# EAGLE design M220 (EAGLE 6.6.0)
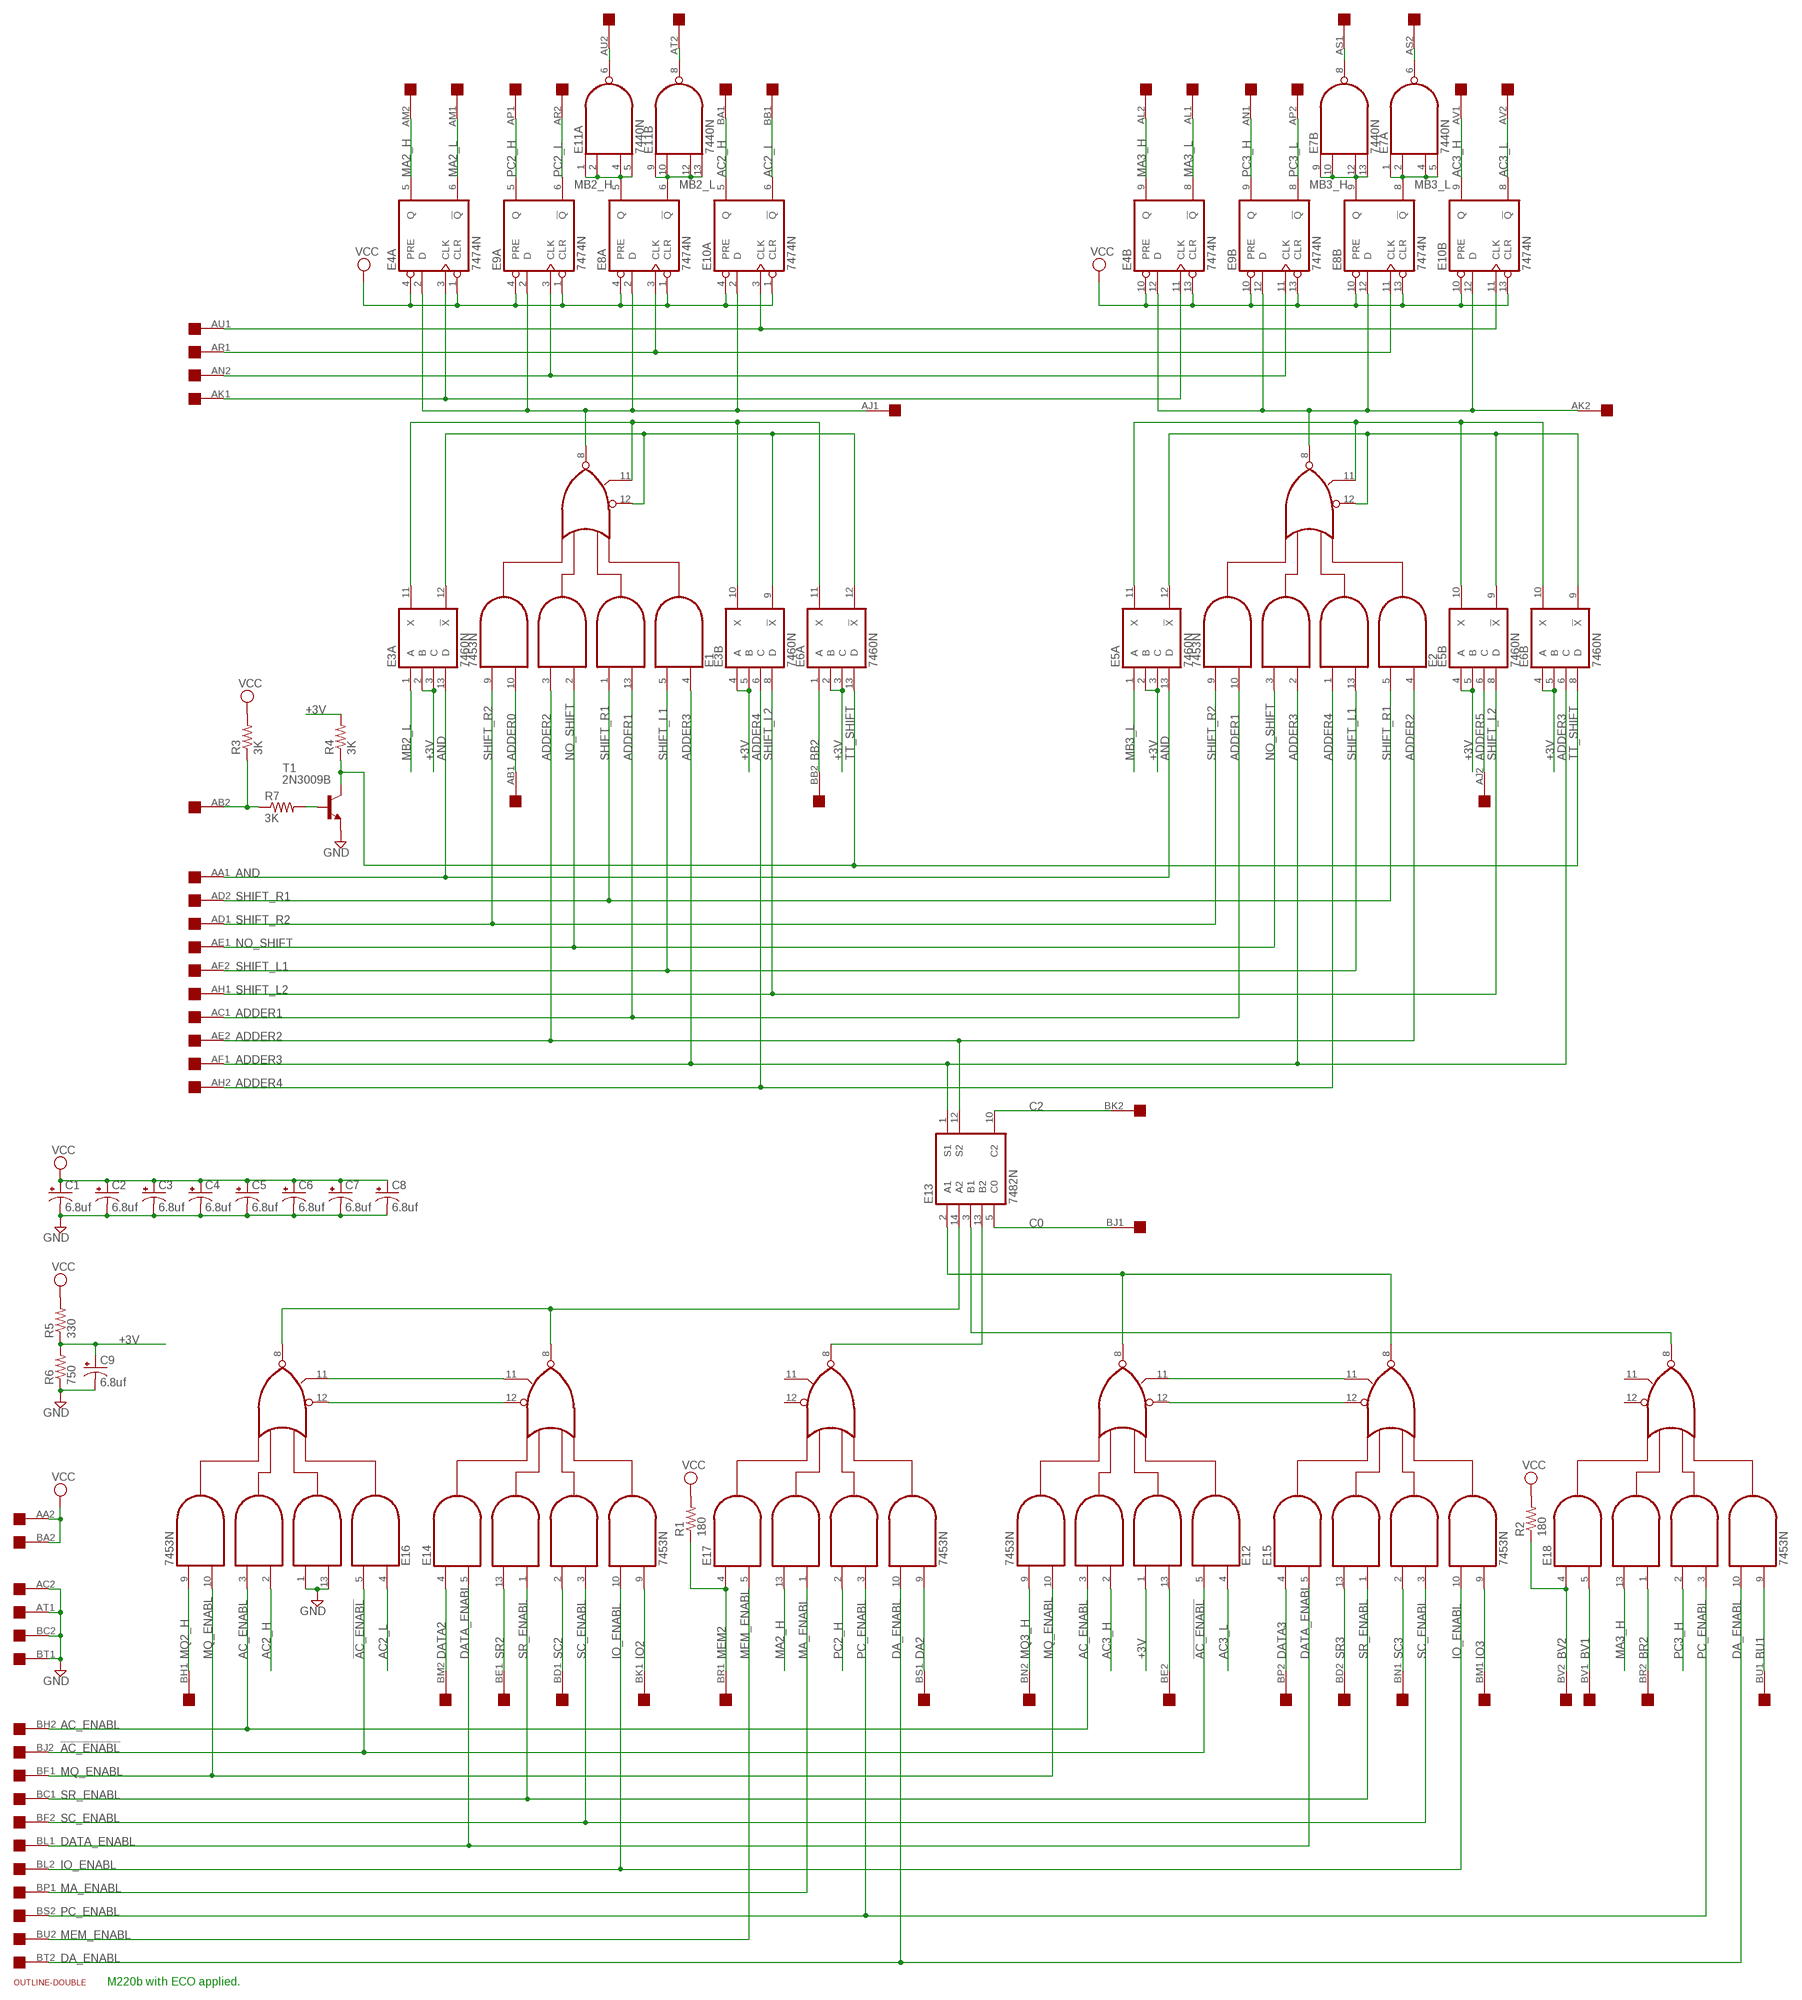
[diagram p0: schematic, sheet 1]

## Parts
C1  6.8uf  CPOL-USE15-5AXIAL  [E15-5]
C2  6.8uf  CPOL-USE15-5AXIAL  [E15-5]
C3  6.8uf  CPOL-USE15-5AXIAL  [E15-5]
C4  6.8uf  CPOL-USE15-5AXIAL  [E15-5]
C5  6.8uf  CPOL-USE15-5AXIAL  [E15-5]
C6  6.8uf  CPOL-USE15-5AXIAL  [E15-5]
C7  6.8uf  CPOL-USE15-5AXIAL  [E15-5]
C8  6.8uf  CPOL-USE15-5AXIAL  [E15-5]
C9  6.8uf  CPOL-USE15-5AXIAL  [E15-5]
E1  7453N  [DIL14]
E2  7453N  [DIL14]
E3  7460N  [DIL14]
E4  7474N  74S74N  [DIL14]
E5  7460N  [DIL14]
E6  7460N  [DIL14]
E7  7440N  74S20N  [DIL14]
E8  7474N  74S74N  [DIL14]
E9  7474N  74S74N  [DIL14]
E10  7474N  74S74N  [DIL14]
E11  7440N  74S20N  [DIL14]
E12  7453N  [DIL14]
E13  7482N  [DIL14]
E14  7453N  [DIL14]
E15  7453N  [DIL14]
E16  7453N  [DIL14]
E17  7453N  [DIL14]
E18  7453N  [DIL14]
R1  180  R-US_0207/10  [0207/10]
R2  180  R-US_0207/10  [0207/10]
R3  3K  R-US_0207/10  [0207/10]
R4  3K  R-US_0207/10  [0207/10]
R5  330  R-US_0207/10  [0207/10]
R6  750  R-US_0207/10  [0207/10]
R7  3K  R-US_0207/10  [0207/10]
T1  2N3009B  2N1613  [TO5]
U$1  DOUBLE  [EDGE-CON4]
U$2  OUTLINE-DOUBLE  [DOUBLE]

## Nets
!AC_ENABL: E12.5(I2) E16.5(I2) U$1.BJ2
!TT_SHIFT: R3.1 R7.1 U$1.AB2
+3V: C9.+ E3.2(A:B) E3.3(A:C) E3.4(B:A) E3.5(B:B) E5.2(A:B) E5.3(A:C) E5.4(B:A) E5.5(B:B) E6.2(A:B) E6.3(A:C) E6.4(B:A) E6.5(B:B) E12.1(I4) R4.2 R5.1 R6.2
AC2_H: E10.5(A:Q) E16.2(I5) U$1.BA1
AC2_L: E10.6(A:!Q) E16.4(I1) U$1.BB1
AC3_H: E10.9(B:Q) E12.2(I5) U$1.AV1
AC3_L: E10.8(B:!Q) E12.4(I1) U$1.AV2
AC_ENABL: E12.3(I6) E16.3(I6) U$1.BH2
ADDER0: E1.10(I7) U$1.AB1
ADDER1: E1.13(I3) E2.10(I7) U$1.AC1
ADDER2: E1.3(I6) E2.4(I1) E13.12(S2) U$1.AE2
ADDER3: E1.4(I1) E2.2(I5) E6.6(B:C) E13.1(S1) U$1.AF1
ADDER4: E2.1(I4) E3.6(B:C) U$1.AH2
ADDER5: E5.6(B:C) U$1.AJ2
AJ1: E1.8(O) E4.2(A:D) E8.2(A:D) E9.2(A:D) E10.2(A:D) U$1.AJ1
AK1: E4.3(A:CLK) E4.11(B:CLK) U$1.AK1
AK2: E2.8(O) E4.12(B:D) E8.12(B:D) E9.12(B:D) E10.12(B:D) U$1.AK2
AN2: E9.3(A:CLK) E9.11(B:CLK) U$1.AN2
AND: E3.13(A:D) E5.13(A:D) U$1.AA1
AR1: E8.3(A:CLK) E8.11(B:CLK) U$1.AR1
AS1: E7.8(B:O) U$1.AS1
AS2: E7.6(A:O) U$1.AS2
AT2: E11.8(B:O) U$1.AT2
AU1: E10.3(A:CLK) E10.11(B:CLK) U$1.AU1
AU2: E11.6(A:O) U$1.AU2
BB2: E6.1(A:A) U$1.BB2
BE2: E12.13(I3) U$1.BE2
BR2: E18.1(I4) U$1.BR2
BU1: E18.9(I8) U$1.BU1
BV1: E18.5(I2) U$1.BV1
BV2: E18.4(I1) R2.1 U$1.BV2
C0: E13.5(C0) U$1.BJ1
C2: E13.10(C2) U$1.BK2
DA2: E17.9(I8) U$1.BS1
DA_ENABL: E17.10(I7) E18.10(I7) U$1.BT2
DATA2: E14.4(I1) U$1.BM2
DATA3: E15.4(I1) U$1.BP2
DATA_ENABL: E14.5(I2) E15.5(I2) U$1.BL1
GND: C1.- C2.- C3.- C4.- C5.- C6.- C7.- C8.- C9.- E16.1(I4) E16.13(I3) R6.1 T1.1(E) U$1.AC2 U$1.AT1 U$1.BC2 U$1.BT1
IO2: E14.9(I8) U$1.BK1
IO3: E15.9(I8) U$1.BM1
IO_ENABL: E14.10(I7) E15.10(I7) U$1.BL2
MA2_H: E4.5(A:Q) E17.13(I3) U$1.AM2
MA2_L: E4.6(A:!Q) U$1.AM1
MA3_H: E4.9(B:Q) E18.13(I3) U$1.AL2
MA3_L: E4.8(B:!Q) U$1.AL1
MA_ENABL: E17.1(I4) U$1.BP1
MB2_H: E8.5(A:Q) E11.1(A:I0) E11.2(A:I1) E11.4(A:I2) E11.5(A:I3)
MB2_L: E3.1(A:A) E8.6(A:!Q) E11.9(B:I0) E11.10(B:I1) E11.12(B:I2) E11.13(B:I3)
MB3_H: E7.9(B:I0) E7.10(B:I1) E7.12(B:I2) E7.13(B:I3) E8.9(B:Q)
MB3_L: E5.1(A:A) E7.1(A:I0) E7.2(A:I1) E7.4(A:I2) E7.5(A:I3) E8.8(B:!Q)
MEM2: E17.4(I1) R1.1 U$1.BR1
MEM_ENABL: E17.5(I2) U$1.BU2
MQ2_H: E16.9(I8) U$1.BH1
MQ3_H: E12.9(I8) U$1.BN2
MQ_ENABL: E12.10(I7) E16.10(I7) U$1.BF1
N$2: E12.12(I9) E15.12(I9)
N$3: R7.2 T1.2(B)
N$4: E12.11(I10) E15.11(I10)
N$5: E13.14(A2) E14.8(O) E16.8(O)
N$6: E14.11(I10) E16.11(I10)
N$7: E14.12(I9) E16.12(I9)
N$8: E12.8(O) E13.2(A1) E15.8(O)
N$9: E2.12(I9) E5.9(B:!X) E5.12(A:!X) E6.9(B:!X)
N$10: E1.12(I9) E3.9(B:!X) E3.12(A:!X) E6.12(A:!X)
N$11: E2.11(I10) E5.10(B:X) E5.11(A:X) E6.10(B:X)
N$12: E13.13(B2) E17.8(O)
N$13: E1.11(I10) E3.10(B:X) E3.11(A:X) E6.11(A:X)
N$14: E13.3(B1) E18.8(O)
NO_SHIFT: E1.2(I5) E2.3(I6) U$1.AE1
PC2_H: E9.5(A:Q) E17.2(I5) U$1.AP1
PC2_L: E9.6(A:!Q) U$1.AR2
PC3_H: E9.9(B:Q) E18.2(I5) U$1.AN1
PC3_L: E9.8(B:!Q) U$1.AP2
PC_ENABL: E17.3(I6) E18.3(I6) U$1.BS2
SC2: E14.2(I5) U$1.BD1
SC3: E15.2(I5) U$1.BN1
SC_ENABL: E14.3(I6) E15.3(I6) U$1.BF2
SHIFT_L1: E1.5(I2) E2.13(I3) U$1.AF2
SHIFT_L2: E3.8(B:D) E5.8(B:D) U$1.AH1
SHIFT_R1: E1.1(I4) E2.5(I2) U$1.AD2
SHIFT_R2: E1.9(I8) E2.9(I8) U$1.AD1
SR2: E14.13(I3) U$1.BE1
SR3: E15.13(I3) U$1.BD2
SR_ENABL: E14.1(I4) E15.1(I4) U$1.BC1
TT_SHIFT: E6.8(B:D) E6.13(A:D) R4.1 T1.3(C)
VCC: C1.+ C2.+ C3.+ C4.+ C5.+ C6.+ C7.+ C8.+ E4.1(A:CLR) E4.4(A:PRE) E4.10(B:PRE) E4.13(B:CLR) E8.1(A:CLR) E8.4(A:PRE) E8.10(B:PRE) E8.13(B:CLR) E9.1(A:CLR) E9.4(A:PRE) E9.10(B:PRE) E9.13(B:CLR) E10.1(A:CLR) E10.4(A:PRE) E10.10(B:PRE) E10.13(B:CLR) R1.2 R2.2 R3.2 R5.2 U$1.AA2 U$1.BA2
Unconnected: E1.6(SPARE) E2.6(SPARE) E12.6(SPARE) E13.6 E13.7 E13.8 E13.9 E14.6(SPARE) E15.6(SPARE) E16.6(SPARE) E17.6(SPARE) E17.11(I10) E17.12(I9) E18.6(SPARE) E18.11(I10) E18.12(I9)

## Notes on the sheet
- M220b with ECO applied.

## Power pins joined to a net without a drawn wire
GND: E1.7(GND) E2.7(GND) E3.7(P:GND) E4.7(P:GND) E5.7(P:GND) E6.7(P:GND) E7.7(P:GND) E8.7(P:GND) E9.7(P:GND) E10.7(P:GND) E11.7(P:GND) E12.7(GND) E13.11(GND) E14.7(GND) E15.7(GND) E16.7(GND) E17.7(GND) E18.7(GND)
VCC: E1.14(VCC) E2.14(VCC) E3.14(P:VCC) E4.14(P:VCC) E5.14(P:VCC) E6.14(P:VCC) E7.14(P:VCC) E8.14(P:VCC) E9.14(P:VCC) E10.14(P:VCC) E11.14(P:VCC) E12.14(VCC) E13.4(VCC) E14.14(VCC) E15.14(VCC) E16.14(VCC) E17.14(VCC) E18.14(VCC)

## Library data of the parts
C1-C9 = rcl:CPOL-US: POLARIZED CAPACITOR, American symbol
E1 E2 E12 E14-E18 = dec-con:74*53: 4-2-3-2 input AND OR INVERTER gates
E3 E5 E6 = 74xx-us:74*60: Dual 4-input EXPANDER
E4 E8-E10 = 74xx-us:74*74: Dual D type positive edge triggered FLIP FLOP, preset and clear
E7 E11 = 74xx-us:74*20: Dual 4-input NAND gate
E13 = dec-con:74*82: 2-bit binary full ADDER Has the wrong GND pin in other libraries.
R1-R7 = rcl:R-US_: RESISTOR, American symbol
T1 = transistor:2N1613: NPN TRANSISTOR
U$1 = dec-con:DOUBLE: Double-Height DEC board
U$2 = dec-con:OUTLINE-*: Board outlines for DEC boards.

## Board
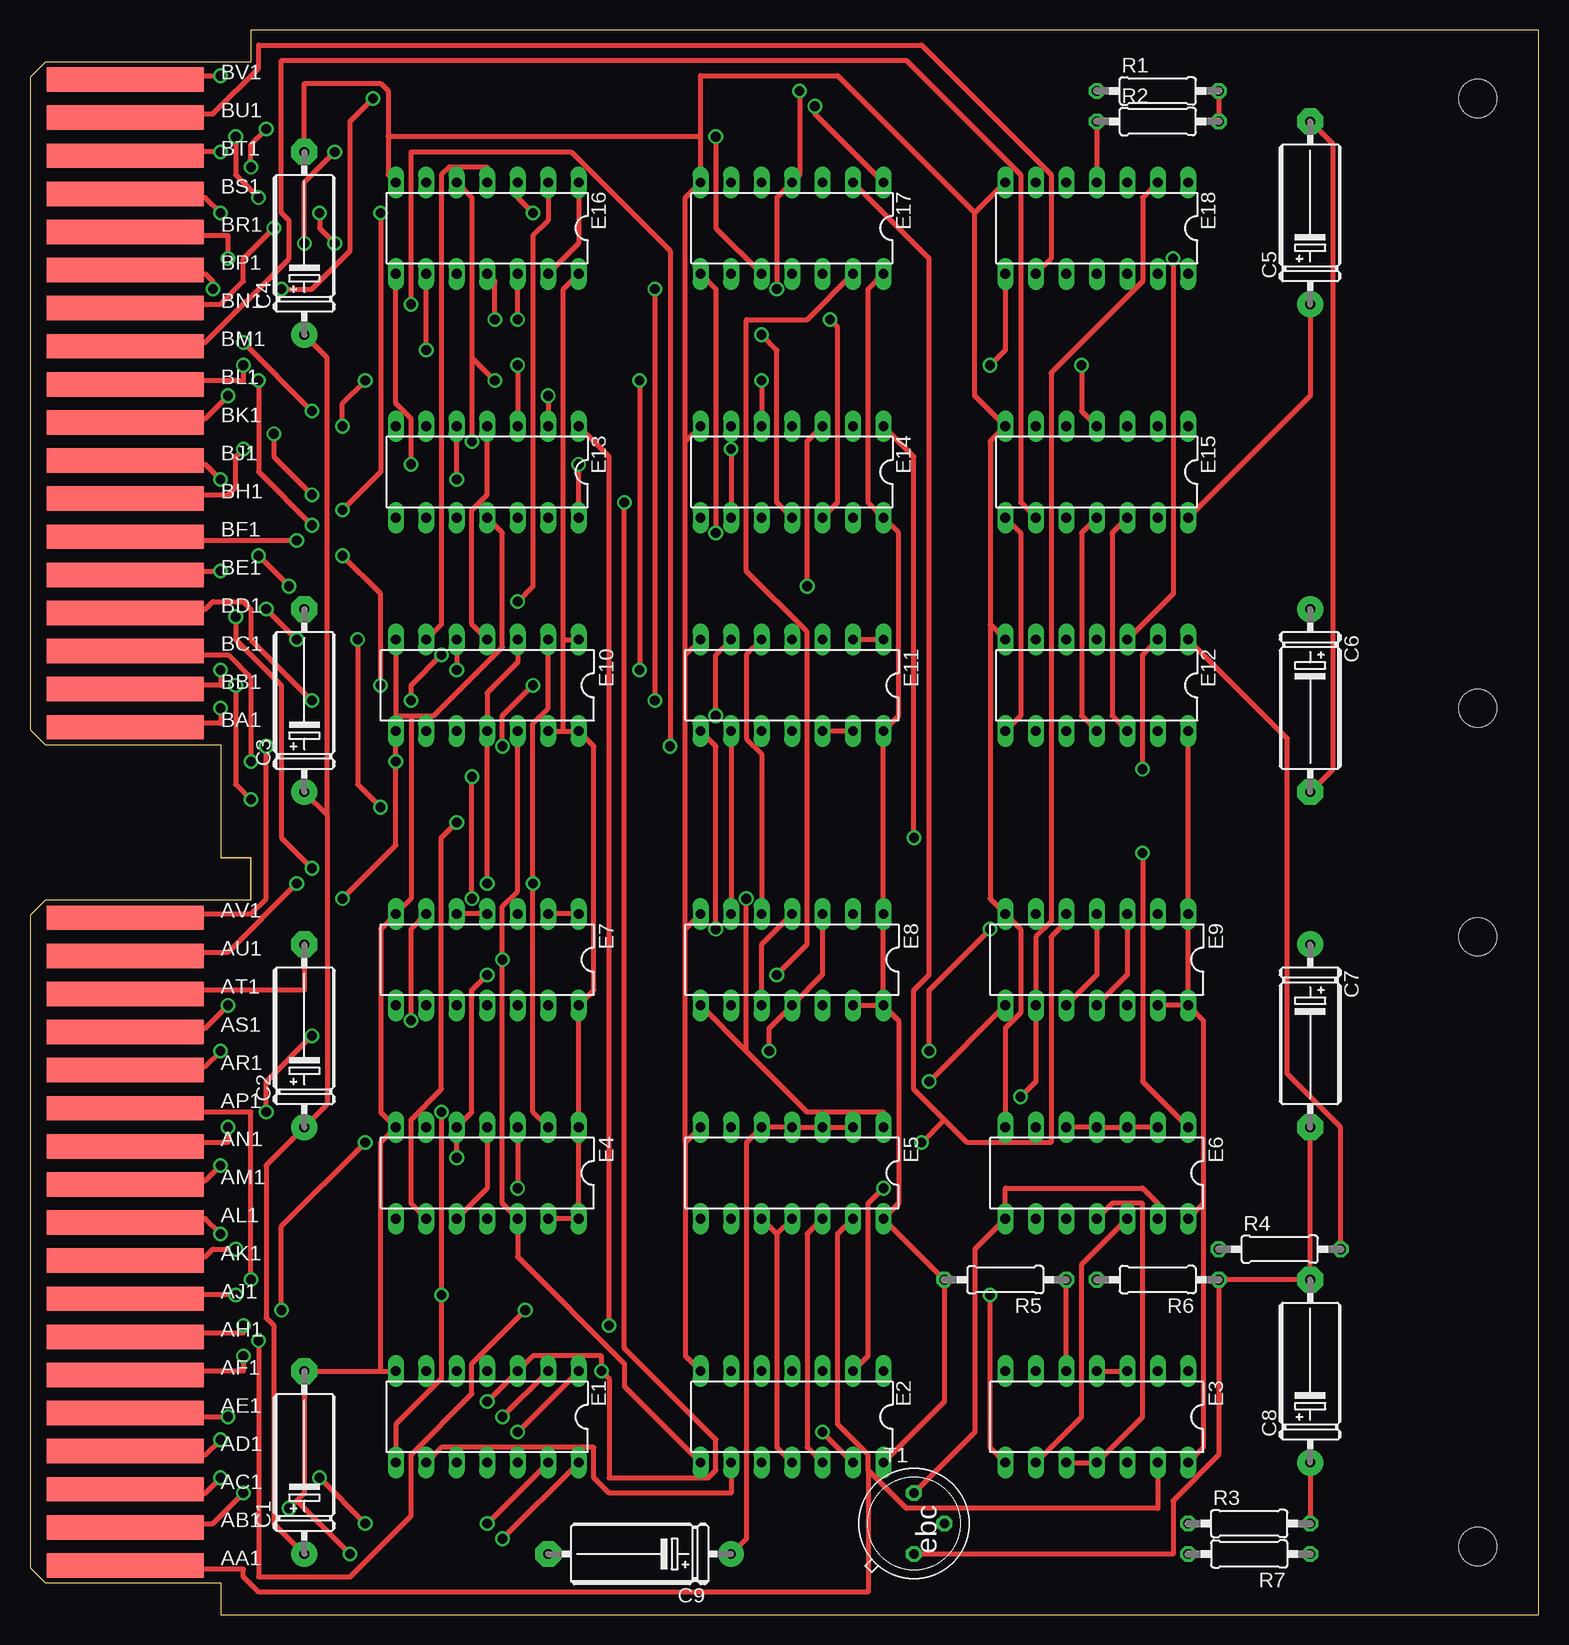
[diagram p1: board, top side]
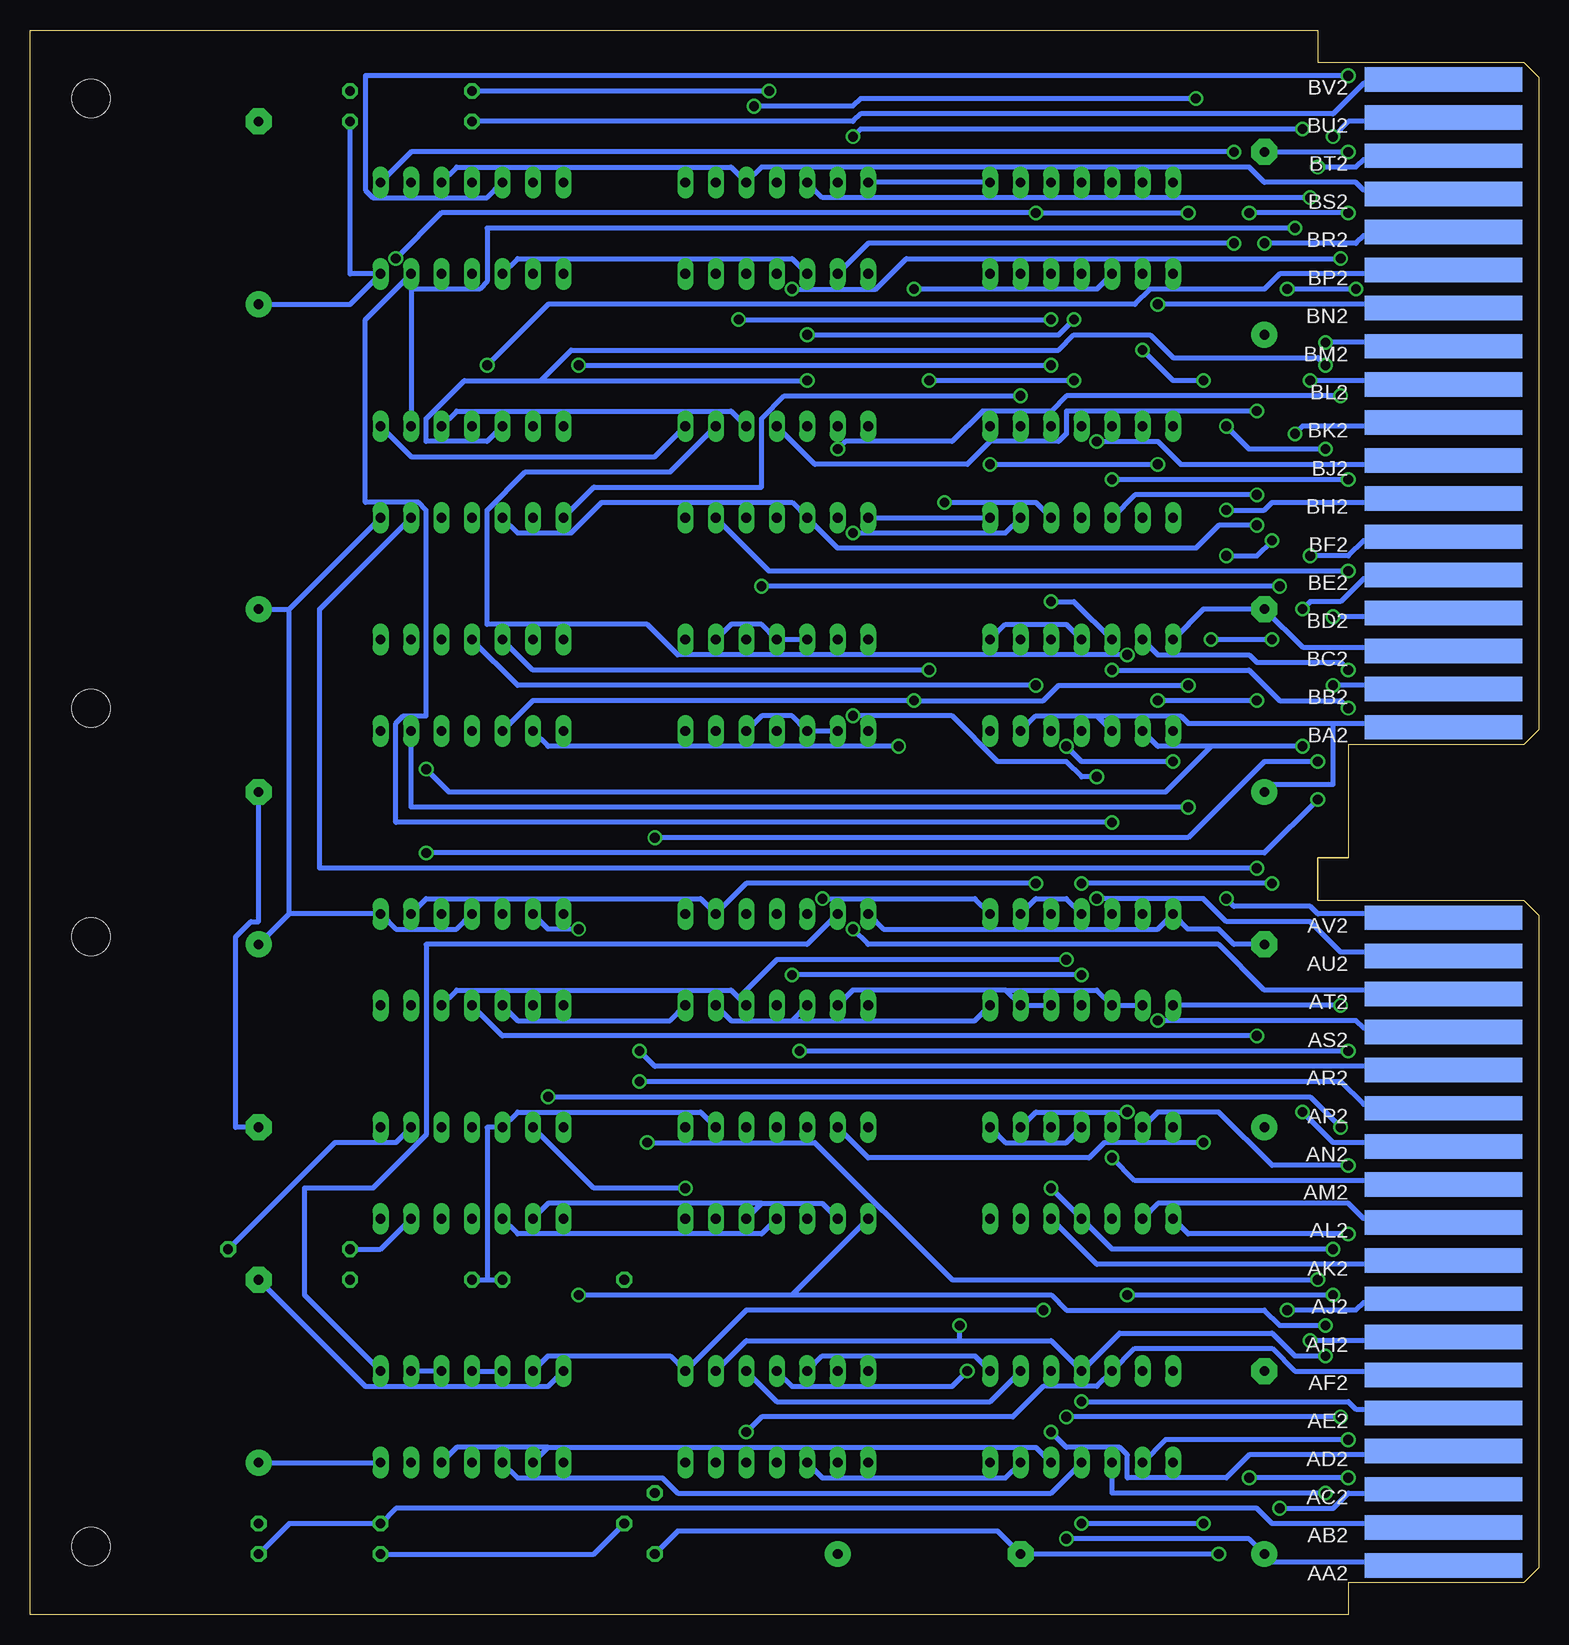
[diagram p2: board, bottom side, seen from below]

Size 125.73 x 132.08 mm. Coordinates in mm from the lower left corner, seen from the top.
Copper layers (1+16): Top 0.035mm / dielectric 1.5mm / Bottom 0.035mm
Design rules "16mils": minimum track width 16mil, minimum drill 32mil, track to track 15mil, track to pad 10mil, pad to pad 10mil, via to via 10mil, smd to smd 10mil, copper to edge 13mil, drill to drill 10mil, minimum pad ring 10mil, minimum via ring 8mil, stop-mask expansion 0mil, vias tented up to drill 0mil, thermal gap 10mil

### Footprints (pad centres in the part's own frame; a part is rotated, then mirrored left to right if it is on the bottom)
E15-5 = drill 0.813 pad 2.159: + -7.62,0 | drill 0.813 pad 2.159 octagon: - 7.62,0
DIL14 = drill 0.813 long: 1 -7.62,-3.81; 2 -5.08,-3.81; 3 -2.54,-3.81; 4 0,-3.81; 5 2.54,-3.81; 6 5.08,-3.81; 7 7.62,-3.81; 8 7.62,3.81; 9 5.08,3.81; 10 2.54,3.81; 11 0,3.81; 12 -2.54,3.81; 13 -5.08,3.81; 14 -7.62,3.81
0207/10 = drill 0.813 octagon: 1 -5.08,0; 2 5.08,0
TO5 = drill 0.813 octagon: 1 0,-2.54; 2 2.54,0; 3 0,2.54
EDGE-CON4 = smd 13.106 x 2.032: AA1 7.938,4.128; AB1 7.938,7.303; AC1 7.938,10.477; AD1 7.938,13.652; AE1 7.938,16.828; AF1 7.938,20.003; AH1 7.938,23.177; AJ1 7.938,26.352; AK1 7.938,29.527; AL1 7.938,32.703; AM1 7.938,35.877; AN1 7.938,39.053; AP1 7.938,42.227; AR1 7.938,45.403; AS1 7.938,48.578; AT1 7.938,51.752; AU1 7.938,54.928; AV1 7.938,58.102; BA1 7.938,73.978; BB1 7.938,77.153; BC1 7.938,80.328; BD1 7.938,83.502; BE1 7.938,86.677; BF1 7.938,89.853; BH1 7.938,93.028; BJ1 7.938,96.203; BK1 7.938,99.377; BL1 7.938,102.552; BM1 7.938,105.728; BN1 7.938,108.903; BP1 7.938,112.078; BR1 7.938,115.252; BS1 7.938,118.427; BT1 7.938,121.603; BU1 7.938,124.778; BV1 7.938,127.953 | smd 13.106 x 2.032 bottom: AA2 7.938,4.128; AB2 7.938,7.303; AC2 7.938,10.477; AD2 7.938,13.652; AE2 7.938,16.828; AF2 7.938,20.003; AH2 7.938,23.177; AJ2 7.938,26.352; AK2 7.938,29.527; AL2 7.938,32.703; AM2 7.938,35.877; AN2 7.938,39.053; AP2 7.938,42.227; AR2 7.938,45.403; AS2 7.938,48.578; AT2 7.938,51.752; AU2 7.938,54.928; AV2 7.938,58.102; BA2 7.938,73.978; BB2 7.938,77.153; BC2 7.938,80.328; BD2 7.938,83.502; BE2 7.938,86.677; BF2 7.938,89.853; BH2 7.938,93.028; BJ2 7.938,96.203; BK2 7.938,99.377; BL2 7.938,102.552; BM2 7.938,105.728; BN2 7.938,108.903; BP2 7.938,112.078; BR2 7.938,115.252; BS2 7.938,118.427; BT2 7.938,121.603; BU2 7.938,124.778; BV2 7.938,127.953
DOUBLE = hole 3.175: 120.65,56.515; 120.65,5.715; 120.65,75.565; 120.65,126.365

### Placement (x,y rotation side)
C1  22.86,12.7 90 top
C2  22.86,48.26 90 top
C3  22.86,76.2 90 top
C4  22.86,114.3 90 top
C5  106.68,116.84 90 top
C6  106.68,76.2 270 top
C7  106.68,48.26 270 top
C8  106.68,20.32 90 top
C9  50.8,5.08 180 top
E1  38.1,16.51 180 top
E2  63.5,16.51 180 top
E3  88.9,16.51 180 top
E4  38.1,36.83 180 top
E5  63.5,36.83 180 top
E6  88.9,36.83 180 top
E7  38.1,54.61 180 top
E8  63.5,54.61 180 top
E9  88.9,54.61 180 top
E10  38.1,77.47 180 top
E11  63.5,77.47 180 top
E12  88.9,77.47 180 top
E13  38.1,95.25 180 top
E14  63.5,95.25 180 top
E15  88.9,95.25 180 top
E16  38.1,115.57 180 top
E17  63.5,115.57 180 top
E18  88.9,115.57 180 top
R1  93.98,127 0 top
R2  93.98,124.46 0 top
R3  101.6,7.62 0 top
R4  104.14,30.48 0 top
R5  81.28,27.94 180 top
R6  93.98,27.94 180 top
R7  101.6,5.08 180 top
T1  73.66,7.62 0 top
U$1  0,0 0 top
U$2  0,0 0 top

### Tracks (layer width: path | path; a pad name or v marks a point on that pad's centre or on a via)
!AC_ENABL  (via drill 0.81)
  Top 0.406: v50.8,102.87 v50.8,78.74 | 36.83,104.78 v38.74,102.87 | 36.83,104.78 36.83,118.11 E16.5 | 36.83,104.78 v36.83,97.79
  Bottom 0.406: E12.5 83.82,78.74 v50.8,78.74 | v38.74,102.87 v50.8,102.87 | v36.83,97.79 31.75,97.79 29.85,95.89 8.26,95.89 U$1.BJ2
!TT_SHIFT
  Bottom 0.406: R7.1 104.14,7.62 R3.1 95.25,8.89 23.5,8.89 22.23,7.62 8.26,7.62 U$1.AB2
+3V
  Top 0.406: E5.2 E5.3 E5.4 E5.5 59.69,39.37 59.69,6.35 C9.+ | E3.4 E3.3 | E3.5 R5.1 | E6.5 E6.4 E6.3 E6.2 | E12.1 104.78,73.03 104.78,45.09 109.22,40.64 R4.2
  Bottom 0.406: R6.2 87.63,27.94 | 87.63,27.94 R5.1 | E3.4 E3.5 | E3.3 E3.2 | R4.2 100.33,39.37 95.25,39.37 E6.2 | 87.63,27.94 87.63,40.64 E6.5 85.09,41.91 69.85,41.91 E5.2
AC2_H  (via drill 0.81)
  Top 0.406: v40.64,84.45 41.91,85.72 41.91,114.94 43.18,116.2 E16.2 | v15.88,75.56 15.88,74.3 8.26,74.3 U$1.BA1 | E10.5 v35.56,78.74
  Bottom 0.406: E10.5 38.74,84.45 v40.64,84.45 | v15.88,75.56 16.51,76.2 21.59,76.2 24.13,78.74 v35.56,78.74
AC2_L  (via drill 0.81)
  Top 0.406: E10.6 34.29,82.55 34.29,120.02 34.93,120.65 38.1,120.65 E16.4 | v15.88,78.74 15.88,77.47 8.26,77.47 U$1.BB1
  Bottom 0.406: v15.88,78.74 16.51,79.38 23.5,79.38 24.13,80.01 31.75,80.01 E10.6
AC3_H  (via drill 0.81)
  Top 0.406: v19.69,72.39 19.69,59.69 18.42,58.42 8.26,58.42 U$1.AV1 | E12.2 92.71,80.01 v92.71,70.48
  Bottom 0.406: E10.9 31.75,72.39 27.31,72.39 | v19.69,72.39 27.31,72.39 | v92.71,70.48 90.81,68.58 31.12,68.58 27.31,72.39
AC3_L  (via drill 0.81)
  Top 0.406: E10.8 v30.48,71.12 30.48,64.14 v26.04,59.69 | v41.91,77.47 39.37,74.93 v39.37,72.39
  Bottom 0.406: v26.04,59.69 25.4,59.05 19.05,59.05 18.42,58.42 8.26,58.42 U$1.AV2 | E12.4 85.09,77.47 v41.91,77.47 | v39.37,72.39 38.1,71.12 v30.48,71.12
AC_ENABL  (via drill 0.81)
  Top 0.406: E12.3 95.25,85.09 v95.25,113.03 | v41.91,116.84 40.64,118.11 E16.3 | v26.04,92.08 29.21,95.25 v29.21,116.84
  Bottom 0.406: v95.25,113.03 91.44,116.84 v41.91,116.84 v29.21,116.84 | v26.04,92.08 22.86,92.08 22.23,92.71 8.26,92.71 U$1.BH2
ADDER0  (via drill 0.81)
  Top 0.406: v17.78,10.16 15.24,7.62 8.26,7.62 U$1.AB1
  Bottom 0.406: E1.10 35.56,10.16 v17.78,10.16
ADDER1  (via drill 0.81)
  Top 0.406: v38.1,7.62 E1.13 | v24.13,11.43 v27.94,7.62 | v15.88,11.43 14.61,10.16 8.26,10.16 U$1.AC1
  Bottom 0.406: E1.13 44.45,11.43 59.69,11.43 E2.10 | v27.94,7.62 v38.1,7.62 | v15.88,11.43 v24.13,11.43
ADDER2  (via drill 0.81)
  Top 0.406: v49.53,92.71 49.53,22.23 57.15,14.61 57.15,12.06 56.52,11.43 48.26,11.43 48.26,19.68 v47.63,20.32 47.63,21.59 41.91,21.59 E1.3 v38.1,17.78
  Bottom 0.406: v47.63,20.32 48.9,19.05 62.23,19.05 E2.4 | E13.12 41.91,92.71 v49.53,92.71 | v38.1,17.78 15.88,17.78 15.24,17.14 8.26,17.14 U$1.AE2
ADDER3  (via drill 0.81)
  Top 0.406: v71.12,35.56 69.85,34.29 69.85,21.59 E2.2 | E13.1 48.26,96.52 v48.26,24.13 | v17.78,21.59 17.78,20.32 8.26,20.32 U$1.AF1
  Bottom 0.406: 48.26,22.86 66.04,22.86 E2.2 | 48.26,22.86 40.64,22.86 E1.4 34.93,23.5 22.23,23.5 20.32,21.59 v17.78,21.59 | E6.6 78.74,35.56 v71.12,35.56 | 48.26,22.86 v48.26,24.13
ADDER4  (via drill 0.81)
  Top 0.406: v41.28,25.4 36.83,20.95 36.83,18.41 31.75,13.34 31.75,8.26 26.67,3.17 19.05,3.17 v19.05,22.86
  Bottom 0.406: E3.6 82.55,21.59 72.39,21.59 E2.1 66.04,25.4 v41.28,25.4 | v19.05,22.86 8.26,22.86 U$1.AH2
ADDER5  (via drill 0.81)
  Top 0.406: v27.94,39.37 20.96,32.38 v20.96,25.4
  Bottom 0.406: E5.6 55.88,38.1 37.47,38.1 36.2,39.37 v27.94,39.37 | v20.96,25.4 15.24,25.4 14.61,26.04 8.26,26.04 U$1.AJ2
AJ1  (via drill 0.81)
  Top 0.406: E1.8 30.48,15.88 34.29,19.68 v34.29,26.67 v34.29,41.91 | E10.2 43.18,75.56 41.91,74.3 v41.91,60.96 41.91,41.91 E4.2 | v17.15,26.67 8.26,26.67 U$1.AJ1
  Bottom 0.406: E9.2 92.71,59.69 69.85,59.69 E8.2 66.04,60.96 v41.91,60.96 | v34.29,41.91 41.91,41.91 E4.2 | v34.29,26.67 v17.15,26.67
AK1  (via drill 0.81)
  Top 0.406: E4.3 v40.64,35.56 | v17.15,30.48 15.24,30.48 14.61,29.84 8.26,29.84 U$1.AK1
  Bottom 0.406: v40.64,35.56 E4.11 35.56,30.48 v17.15,30.48
AK2  (via drill 0.81)
  Top 0.406: E10.12 40.64,60.33 39.37,59.05 v39.37,54.61 39.37,34.29 E4.12 40.64,29.84 49.53,20.95 49.53,19.05 E2.8
  Bottom 0.406: 66.68,51.44 67.31,52.07 90.17,52.07 E9.12 | 66.68,51.44 E8.12 | E4.12 36.83,29.21 8.26,29.21 U$1.AK2 | 66.68,51.44 63.5,54.61 v39.37,54.61
AN2  (via drill 0.81)
  Top 0.406: E9.11 91.44,53.34 E9.3 | v23.5,48.26 19.69,44.45 v19.69,41.91
  Bottom 0.406: E9.11 86.36,48.26 v23.5,48.26 | v19.69,41.91 17.15,39.37 8.26,39.37 U$1.AN2
AND
  Top 0.406: E5.13 67.31,31.75 67.31,15.88 69.85,13.34 69.85,12.06 | 69.85,12.06 73.03,8.89 93.98,8.89 E3.13 | 69.85,12.06 69.85,1.91 19.05,1.91 17.78,3.17 17.78,3.81 8.26,3.81 U$1.AA1
AR1  (via drill 0.81)
  Top 0.406: E8.3 66.04,53.34 E8.11 61.6,48.9 v61.6,46.99 | v15.88,46.99 14.61,45.72 8.26,45.72 U$1.AR1
  Bottom 0.406: v15.88,46.99 v61.6,46.99
AS1  (via drill 0.81)
  Top 0.406: v16.51,50.8 14.61,48.9 8.26,48.9 U$1.AS1
  Bottom 0.406: v16.51,50.8 E7.8
AS2  (via drill 0.81)
  Top 0.406: E7.6 31.75,57.15 v31.75,49.53
  Bottom 0.406: v31.75,49.53 15.24,49.53 14.61,48.9 8.26,48.9 U$1.AS2
AT2  (via drill 0.81)
  Top 0.406: E11.8 57.15,72.39 v57.15,57.15
  Bottom 0.406: v57.15,57.15 55.88,55.88 26.67,55.88 22.86,52.07 8.26,52.07 U$1.AT2
AU1  (via drill 0.81)
  Top 0.406: E10.3 40.64,79.38 38.1,76.83 E10.11 v38.1,60.96 | v22.23,60.96 16.51,55.24 8.26,55.24 U$1.AU1
  Bottom 0.406: v22.23,60.96 v38.1,60.96
AU2  (via drill 0.81)
  Top 0.406: E11.6 57.15,80.01 v57.15,74.93 | v36.83,59.69 v36.83,69.85
  Bottom 0.406: v57.15,74.93 48.9,74.93 45.09,71.12 39.37,71.12 38.1,69.85 v36.83,69.85 | v36.83,59.69 27.94,59.69 26.04,57.78 19.05,57.78 16.51,55.24 8.26,55.24 U$1.AU2
BB2  (via drill 0.81)
  Top 0.406: E6.1 92.71,44.45 v92.71,63.5 | v18.42,67.94 17.15,69.22 v17.15,77.47
  Bottom 0.406: v92.71,63.5 22.86,63.5 v18.42,67.94 | v17.15,77.47 8.26,77.47 U$1.BB2
BE2  (via drill 0.81)
  Top 0.406: v29.21,67.31 27.31,69.22 v27.31,81.28 | v19.69,83.82 v22.23,81.28
  Bottom 0.406: E12.13 93.98,67.31 v29.21,67.31 | v22.23,81.28 v27.31,81.28 | v19.69,83.82 19.05,84.45 16.51,84.45 14.61,86.36 8.26,86.36 U$1.BE2
BR2  (via drill 0.81)
  Top 0.406: v25.4,121.92 22.86,119.38 v22.86,114.3
  Bottom 0.406: E18.1 93.98,121.92 v25.4,121.92 | v22.86,114.3 15.24,114.3 14.61,114.94 8.26,114.94 U$1.BR2
BU1
  Top 0.406: E18.9 85.09,113.03 85.09,120.02 74.3,130.81 19.05,130.81 19.05,128.91 15.24,125.09 8.26,125.09 U$1.BU1
BV1  (via drill 0.81)
  Top 0.406: v15.88,128.27 8.26,128.27 U$1.BV1
  Bottom 0.406: E18.5 87.63,118.11 97.16,118.11 97.79,118.75 97.79,128.27 v15.88,128.27
BV2
  Top 0.406: R2.1 E18.4
  Bottom 0.406: R2.1 57.15,124.46 56.52,125.09 17.15,125.09 14.61,127.64 8.26,127.64 U$1.BV2
C0  (via drill 0.81)
  Top 0.406: v35.56,94.61 E13.5 | v15.88,94.61 14.61,95.89 8.26,95.89 U$1.BJ1
  Bottom 0.406: v15.88,94.61 v35.56,94.61
C2  (via drill 0.81)
  Top 0.406: v23.5,93.34 20.32,96.52 v20.32,98.42
  Bottom 0.406: E13.10 33.66,93.34 v23.5,93.34 | v20.32,98.42 19.69,99.06 8.26,99.06 U$1.BK2
DA2  (via drill 0.81)
  Top 0.406: v25.4,114.3 24.13,115.57 v24.13,116.84 | v15.88,116.84 14.61,118.11 8.26,118.11 U$1.BS1
  Bottom 0.406: E17.9 55.88,114.3 v25.4,114.3 | v15.88,116.84 v24.13,116.84
DA_ENABL  (via drill 0.81)
  Top 0.406: E17.10 57.15,115.57 v57.15,123.19 | v19.69,123.83 18.42,122.56 v18.42,120.65
  Bottom 0.406: E17.10 62.23,113.03 85.09,113.03 E18.10 | v57.15,123.19 56.52,123.83 v19.69,123.83 | v18.42,120.65 15.24,120.65 14.61,121.28 8.26,121.28 U$1.BT2
DATA2  (via drill 0.81)
  Top 0.406: v17.78,106.05 v23.5,100.33
  Bottom 0.406: E14.4 60.33,95.89 47.63,95.89 45.72,97.79 40.01,97.79 39.37,98.42 39.37,100.33 v23.5,100.33 | v17.78,106.05 8.26,106.05 U$1.BM2
DATA3  (via drill 0.81)
  Top 0.406: E15.4 87.63,100.33 v87.63,104.14
  Bottom 0.406: v87.63,104.14 82.55,109.22 33.66,109.22 32.39,110.49 22.86,110.49 21.59,111.76 8.26,111.76 U$1.BP2
DATA_ENABL  (via drill 0.81)
  Top 0.406: v60.96,102.87 E14.5 | v17.78,104.14 17.78,102.87 8.26,102.87 U$1.BL1
  Bottom 0.406: 83.19,102.87 89.54,102.87 92.71,99.69 92.71,97.79 87.63,97.79 E15.5 | 83.19,102.87 v60.96,102.87 | v17.78,104.14 18.42,104.78 30.48,104.78 32.39,106.68 38.74,106.68 40.01,105.41 80.65,105.41 83.19,102.87
GND  (via drill 0.81)
  Top 0.406: C7.- C8.- R6.1 99.06,13.34 95.25,9.53 95.25,5.08 T1.1 | C5.- 108.59,122.56 108.59,70.48 C6.- | 29.21,20.32 C1.- 22.86,10.16 22.23,9.53 | 29.21,20.32 E1.7 | 29.21,20.32 29.21,39.37 E4.7 29.21,41.91 29.21,57.15 E7.7 31.75,59.69 31.75,74.93 | E13.11 39.37,90.17 39.37,80.64 33.66,74.93 31.75,74.93 | 31.75,74.93 30.48,74.93 E10.7 | 22.23,9.53 v21.59,8.89 | C2.- 22.86,52.07 8.26,52.07 U$1.AT1 | E6.7 81.28,48.9 82.55,50.16 82.55,57.15 E9.7 80.01,59.69 80.01,82.55 | 80.01,82.55 E12.7 | 80.01,82.55 80.01,97.79 E15.7 78.74,101.6 78.74,116.84 | 78.74,116.84 E18.7 | E16.7 29.85,120.02 29.85,123.19 | 29.85,123.19 29.85,127 29.21,127.64 22.86,127.64 C4.- | E16.13 45.72,114.3 E16.1 | 55.88,123.19 29.85,123.19 | 55.88,123.19 E17.7 54.61,118.11 54.61,97.79 | v15.88,121.92 8.26,121.92 U$1.BT1 | E2.7 54.61,21.59 54.61,39.37 | E5.7 54.61,39.37 | 54.61,57.15 E8.7 | 54.61,39.37 54.61,57.15 | 54.61,80.01 E11.7 | 54.61,57.15 54.61,80.01 | 54.61,97.79 E14.7 | 54.61,80.01 54.61,97.79 | 78.74,116.84 67.31,128.27 55.88,128.27 55.88,123.19 | 22.23,9.53 v26.67,5.08
  Bottom 0.406: T1.1 71.76,6.99 45.09,6.99 C9.- v26.67,5.08 | E3.7 82.55,19.05 97.79,19.05 C8.- | C6.- 106.68,57.78 107.32,57.78 108.59,56.52 108.59,40.64 C7.- | C2.- 25.4,55.88 26.67,57.15 29.21,57.15 E7.7 31.75,57.15 54.61,57.15 E8.7 | E10.7 27.94,83.82 C3.- 19.69,80.64 8.26,80.64 U$1.BC2 | v21.59,8.89 17.15,8.89 15.88,10.16 8.26,10.16 U$1.AC2 | E16.1 E17.7 | C4.- v15.88,121.92
IO2  (via drill 0.81)
  Top 0.406: v58.42,97.16 E14.9 | v16.51,101.6 14.61,99.69 8.26,99.69 U$1.BK1
  Bottom 0.406: v58.42,97.16 57.79,97.79 48.9,97.79 46.36,100.33 40.64,100.33 39.37,101.6 v16.51,101.6
IO3
  Top 0.406: E15.9 82.55,92.71 82.55,120.02 73.03,129.54 20.96,129.54 20.96,116.84 21.59,116.2 21.59,113.03 14.61,106.05 8.26,106.05 U$1.BM1
IO_ENABL  (via drill 0.81)
  Top 0.406: v23.5,90.81 19.05,95.25 v19.05,102.87
  Bottom 0.406: E15.10 85.09,90.17 80.65,90.17 78.11,92.71 62.23,92.71 E14.10 58.42,88.9 28.58,88.9 26.67,90.81 v23.5,90.81 | v19.05,102.87 8.26,102.87 U$1.BL2
MA2_H  (via drill 0.81)
  Top 0.406: v35.56,38.1 E4.5 36.83,41.91 36.83,52.07 v38.1,53.34 | E17.13 64.77,107.95 59.69,107.95 59.69,87 64.77,81.92 64.77,55.88 v62.23,53.34
  Bottom 0.406: v35.56,38.1 33.66,36.2 8.26,36.2 U$1.AM2 | v38.1,53.34 v62.23,53.34
MA2_L  (via drill 0.81)
  Top 0.406: v15.88,37.47 14.61,36.2 8.26,36.2 U$1.AM1
  Bottom 0.406: E4.6 31.75,41.91 26.67,41.91 22.23,37.47 v15.88,37.47
MA3_H  (via drill 0.81)
  Top 0.406: v35.56,66.04 34.29,64.77 34.29,43.81 31.75,41.27 31.75,34.29 E4.9
  Bottom 0.406: E4.9 31.75,34.29 15.88,34.29 14.61,33.02 8.26,33.02 U$1.AL2 | E18.13 97.79,107.95 97.79,92.71 93.35,92.71 92.71,92.08 92.71,74.93 94.62,74.93 95.25,74.3 95.25,66.04 v35.56,66.04
MA3_L  (via drill 0.81)
  Top 0.406: v15.88,31.75 14.61,33.02 8.26,33.02 U$1.AL1
  Bottom 0.406: E4.8 29.21,31.75 v15.88,31.75
MA_ENABL  (via drill 0.81)
  Top 0.406: E17.1 65.41,125.09 v65.41,125.73 | v28.58,126.36 26.67,124.46 26.67,113.67 23.5,110.49 v20.96,110.49 | v15.24,110.49 15.24,111.12 14.61,111.76 8.26,111.76 U$1.BP1
  Bottom 0.406: v65.41,125.73 57.15,125.73 56.52,126.36 v28.58,126.36 | v15.24,110.49 v20.96,110.49
MB2_H
  Top 0.406: E11.1 E11.2 | E8.5 60.96,71.75 59.69,73.03 59.69,80.01 E11.5
  Bottom 0.406: E11.5 E11.4 64.77,82.55 67.31,82.55 E11.2
MB2_L
  Top 0.406: E11.13 E11.12 | E11.9 E8.6
  Bottom 0.406: E11.9 E11.10 62.23,74.93 64.77,74.93 E11.12 | E3.1 102.87,26.67 102.87,35.56 97.16,35.56 92.71,40.01 92.71,55.88 60.96,55.88 E8.6
MB3_H
  Bottom 0.406: E7.9 E7.10 36.83,52.07 44.45,52.07 | E7.12 E7.13 44.45,52.07 | E8.9 57.15,52.07 44.45,52.07
MB3_L  (via drill 0.81)
  Top 0.406: E7.4 E7.5 | E7.1 E7.2 | 59.69,46.99 64.77,41.91 71.12,41.91 E5.1 | 59.69,46.99 E8.8 | 59.69,46.99 v59.69,59.69
  Bottom 0.406: E7.4 39.37,59.69 41.91,59.69 E7.2 | E7.1 46.99,59.69 v59.69,59.69
MEM2  (via drill 0.81)
  Top 0.406: v64.14,127 64.14,120.02 E17.4 62.23,118.11 v62.23,110.49 | v16.51,113.03 16.51,114.94 8.26,114.94 U$1.BR1
  Bottom 0.406: R1.1 v64.14,127 | v16.51,113.03 52.71,113.03 55.25,110.49 v62.23,110.49
MEM_ENABL  (via drill 0.81)
  Top 0.406: v19.05,118.11 17.15,120.02 v17.15,123.19
  Bottom 0.406: E17.5 59.69,118.11 v19.05,118.11 | v17.15,123.19 15.88,124.46 8.26,124.46 U$1.BU2
MQ2_H  (via drill 0.81)
  Top 0.406: v33.02,105.41 E16.9 | v27.94,102.87 26.04,100.97 v26.04,99.06 | v17.78,97.16 17.15,96.52 17.15,93.98 16.51,93.34 8.26,93.34 U$1.BH1
  Bottom 0.406: v33.02,105.41 30.48,102.87 v27.94,102.87 | v26.04,99.06 24.13,97.16 v17.78,97.16
MQ3_H  (via drill 0.81)
  Top 0.406: v53.34,72.39 53.34,113.67 45.09,121.92 31.75,121.92 v31.75,109.22
  Bottom 0.406: E12.9 82.55,72.39 v53.34,72.39 | v31.75,109.22 8.26,109.22 U$1.BN2
MQ_ENABL  (via drill 0.81)
  Top 0.406: v52.07,110.49 v52.07,76.2 | v22.23,89.53 8.26,89.53 U$1.BF1 | v26.04,88.27 29.21,85.09 v29.21,77.47
  Bottom 0.406: E12.10 83.82,76.2 v52.07,76.2 41.28,76.2 40.01,77.47 v29.21,77.47 | v52.07,110.49 36.83,110.49 E16.10 | v22.23,89.53 23.5,88.27 v26.04,88.27
N$2
  Top 0.406: E12.12 90.17,74.93 90.17,90.17 E15.12
N$3
  Bottom 0.406: T1.2 78.74,5.08 R7.2
N$4
  Top 0.406: E12.11 87.63,74.93 87.63,90.17 E15.11
N$5  (via drill 0.81)
  Top 0.406: E16.8 30.48,100.97 31.75,99.69 v31.75,95.89 | E13.14 v45.72,95.89
  Bottom 0.406: E14.8 E13.14 | v45.72,95.89 v31.75,95.89
N$6  (via drill 0.81)
  Top 0.406: E16.11 38.74,111.12 v38.74,107.95 | v60.96,106.68 62.23,105.41 62.23,92.71 E14.11
  Bottom 0.406: v38.74,107.95 40.01,106.68 v60.96,106.68
N$7  (via drill 0.81)
  Top 0.406: v40.64,107.95 E16.12 | v66.68,107.95 67.31,107.31 67.31,92.71 E14.12
  Bottom 0.406: v66.68,107.95 v40.64,107.95
N$8  (via drill 0.81)
  Top 0.406: E12.8 82.55,74.93 82.55,90.17 E15.8 | v43.18,101.6 E13.2
  Bottom 0.406: v43.18,101.6 62.87,101.6 64.77,99.69 64.77,93.98 78.74,93.98 E15.8
N$9
  Top 0.406: E2.12 64.77,13.97 64.77,31.75 E5.12
  Bottom 0.406: E5.9 59.69,34.29 64.77,34.29 | E5.12 64.77,34.29 | E6.9 82.55,34.29 64.77,34.29
N$10
  Top 0.406: E6.12 87.63,29.21 87.63,16.51 E3.9
  Bottom 0.406: E1.12 41.91,13.97 82.55,13.97 | E3.9 82.55,13.97 | E3.12 90.17,13.97 82.55,13.97
N$11
  Top 0.406: E2.11 62.23,13.97 62.23,31.75 | E5.10 62.23,31.75 | 62.23,31.75 E5.11
  Bottom 0.406: E6.10 85.09,31.75 64.77,31.75 E5.11
N$12  (via drill 0.81)
  Top 0.406: v57.15,90.17 57.15,110.49 E17.8
  Bottom 0.406: E13.13 44.45,90.17 v57.15,90.17
N$13
  Top 0.406: E3.10 E3.11 92.71,16.51 92.71,34.29 90.17,34.29 E6.11
  Bottom 0.406: E1.11 40.64,10.16 71.76,10.16 73.03,11.43 85.09,11.43 E3.10
N$14  (via drill 0.81)
  Top 0.406: v40.64,104.14 E13.3 | v80.01,104.14 81.28,105.41 E18.8
  Bottom 0.406: v80.01,104.14 v40.64,104.14
NO_SHIFT  (via drill 0.81)
  Top 0.406: v39.37,16.51 E1.2 | v16.51,16.51 8.26,16.51 U$1.AE1
  Bottom 0.406: E1.2 45.72,17.78 63.5,17.78 E2.3 | v16.51,16.51 v39.37,16.51
PC2_H  (via drill 0.81)
  Top 0.406: E17.2 74.93,113.03 74.93,53.34 73.66,52.07 73.66,43.81 76.2,41.27 | 76.2,41.27 78.11,39.37 85.09,39.37 85.09,56.52 86.36,57.78 E9.5 | v18.42,27.94 18.42,41.91 8.26,41.91 U$1.AP1 | 76.2,41.27 v74.3,39.37
  Bottom 0.406: v18.42,27.94 48.9,27.94 60.33,39.37 v74.3,39.37
PC2_L  (via drill 0.81)
  Top 0.406: v80.01,57.15 74.93,52.07 v74.93,46.99
  Bottom 0.406: E9.6 82.55,57.15 v80.01,57.15 | v74.93,46.99 73.66,45.72 8.26,45.72 U$1.AR2
PC3_H  (via drill 0.81)
  Top 0.406: E18.2 92.71,118.11 92.71,111.12 85.09,103.5 85.09,57.78 83.82,56.52 E9.9 83.82,44.45 v82.55,43.18 | v16.51,40.64 16.51,39.37 8.26,39.37 U$1.AN1
  Bottom 0.406: v16.51,40.64 19.05,43.18 v82.55,43.18
PC3_L  (via drill 0.81)
  Top 0.406: v74.93,44.45 E9.8
  Bottom 0.406: v74.93,44.45 16.51,44.45 14.61,42.55 8.26,42.55 U$1.AP2
PC_ENABL
  Bottom 0.406: E18.3 90.17,120.65 67.31,120.65 E17.3 64.77,120.65 24.13,120.65 22.86,119.38 15.24,119.38 14.61,118.75 8.26,118.75 U$1.BS2
SC2  (via drill 0.81)
  Top 0.406: v34.29,80.01 31.75,77.47 v31.75,76.2 | v23.5,76.2 18.42,81.28 18.42,83.82 17.78,84.45 15.24,84.45 14.61,83.82 8.26,83.82 U$1.BD1
  Bottom 0.406: E14.2 72.39,95.25 84.46,95.25 87.63,92.08 87.63,82.55 74.3,82.55 71.76,80.01 v34.29,80.01 | v23.5,76.2 v31.75,76.2
SC3  (via drill 0.81)
  Top 0.406: v20.32,115.57 17.78,113.03 17.78,111.12 15.88,109.22 8.26,109.22 U$1.BN1
  Bottom 0.406: E15.2 93.98,110.49 88.27,110.49 87.63,111.12 87.63,115.57 v20.32,115.57
SC_ENABL  (via drill 0.81)
  Top 0.406: E14.3 64.77,97.79 v64.77,85.72 | v19.05,88.27 v21.59,85.72
  Bottom 0.406: E14.3 67.31,100.33 90.17,100.33 E15.3 | v21.59,85.72 v64.77,85.72 | v19.05,88.27 15.88,88.27 14.61,89.53 8.26,89.53 U$1.BF2
SHIFT_L1  (via drill 0.81)
  Top 0.406: v66.04,15.24 E2.13
  Bottom 0.406: v66.04,15.24 64.77,16.51 43.82,16.51 41.28,19.05 36.83,19.05 E1.5 33.66,22.23 22.23,22.23 20.32,20.32 8.26,20.32 U$1.AF2
SHIFT_L2  (via drill 0.81)
  Top 0.406: v80.01,26.67 80.01,13.97 E3.8 | v17.78,24.13 17.78,23.5 8.26,23.5 U$1.AH1
  Bottom 0.406: 62.23,26.67 E5.8 | v80.01,26.67 62.23,26.67 | v17.78,24.13 21.59,24.13 22.86,25.4 39.37,25.4 40.64,26.67 62.23,26.67
SHIFT_R1  (via drill 0.81)
  Top 0.406: v40.64,15.24 E1.1
  Bottom 0.406: E1.1 46.99,21.59 59.69,21.59 E2.5 | v40.64,15.24 39.37,13.97 34.93,13.97 34.29,13.34 34.29,11.43 26.04,11.43 24.13,13.34 8.26,13.34 U$1.AD2
SHIFT_R2  (via drill 0.81)
  Top 0.406: E1.9 34.29,13.97 46.99,13.97 46.99,11.43 48.26,10.16 58.42,10.16 E2.9 | v15.88,14.61 14.61,13.34 8.26,13.34 U$1.AD1
  Bottom 0.406: E1.9 31.12,14.61 v15.88,14.61
SR2  (via drill 0.81)
  Top 0.406: v15.88,87 8.26,87 U$1.BE1
  Bottom 0.406: E14.13 64.14,87 v15.88,87
SR3  (via drill 0.81)
  Top 0.406: v23.5,62.23 20.96,64.77 20.96,77.47 17.15,81.28 v17.15,83.19
  Bottom 0.406: E15.13 101.6,83.82 101.6,62.23 v23.5,62.23 | v17.15,83.19 8.26,83.19 U$1.BD2
SR_ENABL  (via drill 0.81)
  Top 0.406: E14.1 73.66,96.52 v73.66,64.77 | v18.42,71.12 18.42,78.11 16.51,80.01 8.26,80.01 U$1.BC1
  Bottom 0.406: E14.1 73.66,96.52 93.98,96.52 E15.1 | v73.66,64.77 29.21,64.77 22.86,71.12 v18.42,71.12
TT_SHIFT
  Top 0.406: T1.3 78.74,15.24 78.74,30.48 E6.8 81.28,35.56 92.71,35.56 93.98,34.29 E6.13
  Bottom 0.406: E6.13 96.52,30.48 R4.1
VCC  (via drill 0.81)
  Top 0.406: E13.4 38.1,93.34 36.83,92.08 36.83,82.55 E10.4 | E10.13 44.45,73.66 | 44.45,73.66 E10.14 46.99,72.39 46.99,52.07 E7.14 E4.1 E4.14 E4.13 | E16.14 44.45,110.49 44.45,81.28 | 44.45,73.66 44.45,81.28 | 44.45,81.28 E10.1 | v39.37,6.35 E1.14 | 24.77,66.67 24.77,42.55 C2.+ 19.69,37.47 19.69,24.77 20.32,24.13 20.32,7.62 C1.+ | C3.+ 24.77,66.67 | C4.+ 24.77,104.78 24.77,66.67 | E4.10 38.1,35.56 E4.4 | E2.14 76.2,17.78 R5.2 E5.14 72.39,34.29 72.39,49.53 E8.14 | E8.4 60.96,55.88 E8.10 | E8.13 E8.14 | E8.14 E8.1 E11.14 72.39,74.93 72.39,90.17 E14.14 69.85,92.71 69.85,110.49 E17.14 | R1.2 R2.2 | E15.14 106.68,101.6 C5.+ | C8.+ R3.2 | E9.10 88.9,53.34 E9.4 | E9.14 E9.13 | 97.79,34.29 E6.14 | 97.79,34.29 97.79,49.53 E9.14 | E9.14 E9.1 E12.14 | E3.14 97.79,13.97 97.79,34.29
  Bottom 0.406: E10.4 39.37,82.55 44.45,82.55 E10.1 | 36.83,74.93 E10.10 | 36.83,74.93 41.91,74.93 E10.13 | 17.15,74.3 29.21,74.3 29.85,74.93 36.83,74.93 | 17.15,74.3 8.26,74.3 U$1.BA2 | v39.37,6.35 24.13,6.35 C1.+ 22.23,4.45 8.26,4.45 U$1.AA2 | 17.15,74.3 17.15,69.22 22.23,69.22 C3.+ | E4.4 39.37,39.37 44.45,39.37 E4.1 | 62.23,49.53 E8.10 | 62.23,49.53 67.31,49.53 E8.13 | E7.14 46.99,49.53 62.23,49.53 | 104.14,83.82 E15.14 | C6.+ 104.14,83.82 | C5.+ 99.06,109.22 E18.14 99.06,111.76 R2.2 | C8.+ E3.14 | 104.14,58.42 C7.+ | 104.14,58.42 E9.1 95.25,57.15 90.17,57.15 E9.4 | 104.14,58.42 104.14,83.82 | E8.14 72.39,49.53 85.09,49.53 E9.10

### Text on the board
tPlace: ebc